# EAGLE design ADK_MEGA_2560-REV3 (EAGLE 6.5.0)
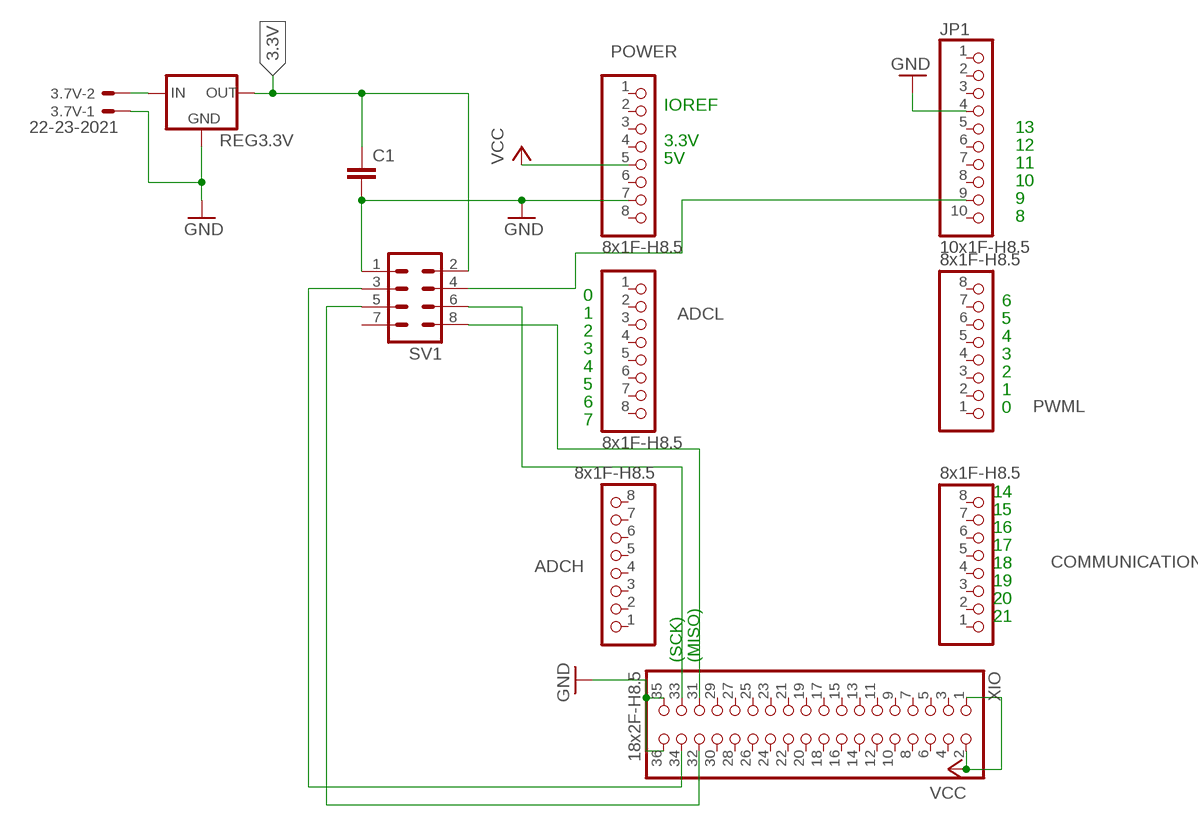
[diagram p0: schematic, sheet 1]

## Parts
3.7V  22-23-2021  [22-23-2021]
ADCH  8x1F-H8.5  PINHD-1X8  [1X08]
ADCL  8x1F-H8.5  PINHD-1X8  [1X08]
C1  C-EU025-025X050  [C025-025X050]
COMMUNICATION  8x1F-H8.5  PINHD-1X8  [1X08]
JP1  10x1F-H8.5  PINHD-1X10  [1X10]
POWER  8x1F-H8.5  PINHD-1X8  [1X08]
PWML  8x1F-H8.5  PINHD-1X8  [1X08]
REG3.3V  78XXL  [78XXL]
SV1  MA04-2  [MA04-2]
XIO  18x2F-H8.5  PINHD-2X18  [2X18]

## Nets
3.3V: C1.1 REG3.3V.OUT SV1.2
GND: 3.7V.1 C1.2 JP1.4 POWER.7 REG3.3V.GND SV1.1 XIO.35 XIO.36
N$1: SV1.3 XIO.34
N$5: SV1.5 XIO.32
N$6: JP1.9 SV1.4
N$7: SV1.6 XIO.33
N$8: SV1.8 XIO.31
N$9: 3.7V.2 REG3.3V.IN
VCC: POWER.5 XIO.1 XIO.2
Unconnected: ADCH.1 ADCH.2 ADCH.3 ADCH.4 ADCH.5 ADCH.6 ADCH.7 ADCH.8 ADCL.1 ADCL.2 ADCL.3 ADCL.4 ADCL.5 ADCL.6 ADCL.7 ADCL.8 COMMUNICATION.1 COMMUNICATION.2 COMMUNICATION.3 COMMUNICATION.4 COMMUNICATION.5 COMMUNICATION.6 COMMUNICATION.7 COMMUNICATION.8 JP1.1 JP1.2 JP1.3 JP1.5 JP1.6 JP1.7 JP1.8 JP1.10 POWER.1 POWER.2 POWER.3 POWER.4 POWER.6 POWER.8 PWML.1 PWML.2 PWML.3 PWML.4 PWML.5 PWML.6 PWML.7 PWML.8 SV1.7 XIO.3 XIO.4 XIO.5 XIO.6 XIO.7 XIO.8 XIO.9 XIO.10 XIO.11 XIO.12 XIO.13 XIO.14 XIO.15 XIO.16 XIO.17 XIO.18 XIO.19 XIO.20 XIO.21 XIO.22 XIO.23 XIO.24 XIO.25 XIO.26 XIO.27 XIO.28 XIO.29 XIO.30

## Notes on the sheet
- IOREF
- 13
- 3.3V | 12
- 5V | 11
- 10
- 9
- 8
- 0
- 1 | 6
- 2 | 5
- 3 | 4
- 4 | 3
- 5 | 2
- 6 | 1
- 7 | 0
- 14
- 15
- 16
- 17
- 18
- 19
- 20
- 21
- (SCK) | (MISO)

## Library data of the parts
3.7V = con-molex:22-23-2021: .100" (2.54mm) Center Header - 2 Pin; MF: MOLEX; MPN: 22-23-2021; OC_FARNELL: 1462926; OC_NEWARK: 25C3832
ADCH ADCL COMMUNICATION POWER PWML = SmartPrj:PINHD-1X8: PIN HEADER
C1 = rcl:C-EU: CAPACITOR, European symbol
JP1 = SmartPrj:PINHD-1X10: PIN HEADER
REG3.3V = v-reg:78XXL: VOLTAGE REGULATOR
SV1 = con-lstb:MA04-2: PIN HEADER; OC_FARNELL: unknown; OC_NEWARK: unknown
XIO = SmartPrj:PINHD-2X18: PIN HEADER

## Net classes
0 default: width 0.203 mm, drill 0.406 mm, clearance 0.178 mm
1 power: width 0.305 mm, drill 0.406 mm, clearance 0.178 mm
2 gnd: width 0.305 mm, drill 0.406 mm, clearance 0.178 mm
3 power usb: width 0.508 mm, drill 0.406 mm, clearance 0.178 mm

## Board
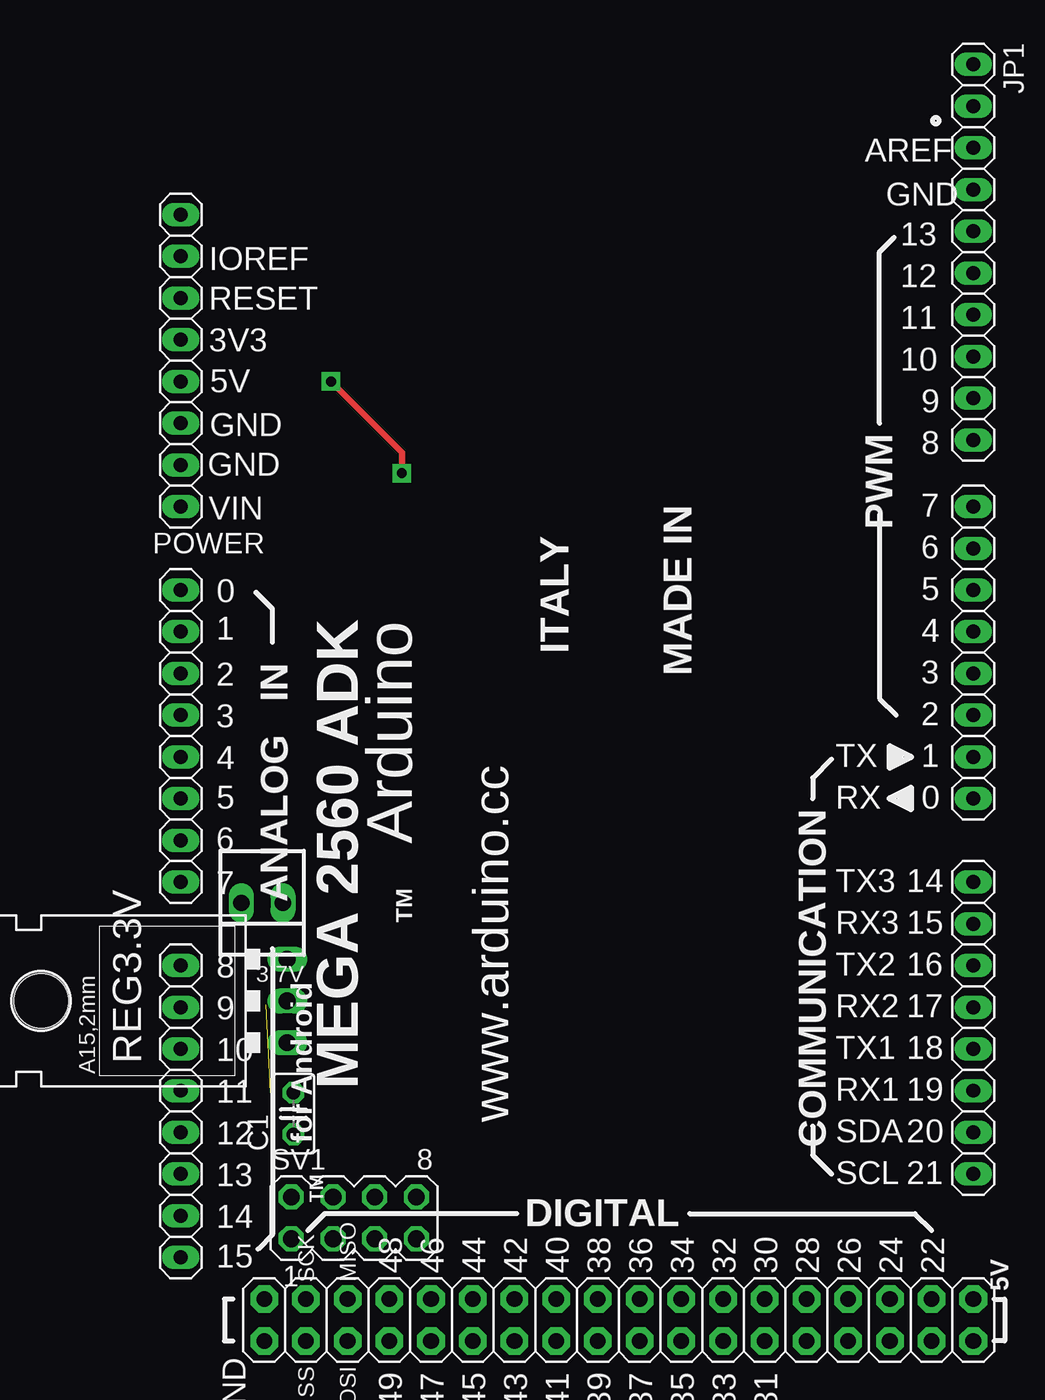
[diagram p1: board, top side]
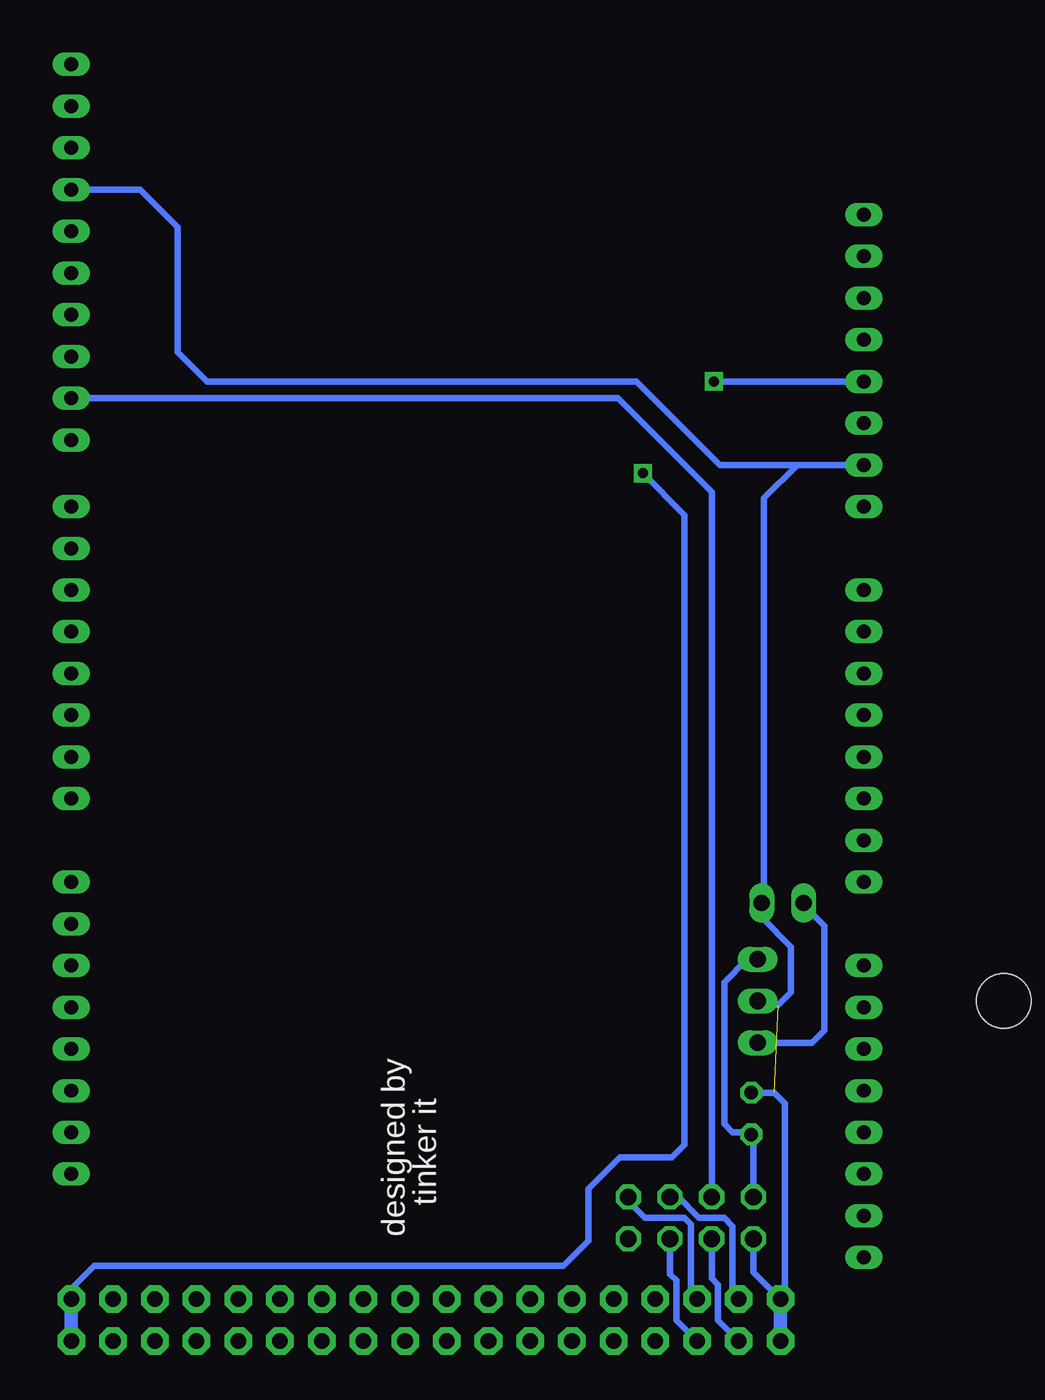
[diagram p2: board, bottom side, seen from below]

No outline drawn. Coordinates in mm, seen from the top.
Copper layers (1*16): Top 0.035mm / dielectric 1.5mm / Bottom 0.035mm
Design rules "ArduinoMegaHOST *": minimum track width 8mil, minimum drill 16mil, track to track 7mil, track to pad 7mil, pad to pad 7mil, via to via 10mil, smd to smd 7mil, copper to edge 20mil, drill to drill 12mil, minimum pad ring 10mil, minimum via ring 10mil, stop-mask expansion 2mil, vias tented up to drill 20mil, thermal gap 10mil

### Footprints (pad centres in the part's own frame; a part is rotated, then mirrored left to right if it is on the bottom)
22-23-2021 = drill 1 long: 1 -1.27,0; 2 1.27,0
1X08 = drill 0.85 pad 1.422 long: 1 -8.89,0; 2 -6.35,0; 3 -3.81,0; 4 -1.27,0; 5 1.27,0; 6 3.81,0; 7 6.35,0; 8 8.89,0
C025-025X050 = drill 0.813 octagon: 1 -1.27,0; 2 1.27,0
1X10 = drill 0.85 pad 1.422 long: 1 -11.43,0; 2 -8.89,0; 3 -6.35,0; 4 -3.81,0; 5 -1.27,0; 6 1.27,0; 7 3.81,0; 8 6.35,0; 9 8.89,0; 10 11.43,0
78XXL = drill 1.016 long: GND 0,-3.81; IN -2.54,-3.81; OUT 2.54,-3.81 | hole 3.302: 0,11.176
MA04-2 = drill 1.016 octagon: 1 -3.81,-1.27; 2 -3.81,1.27; 3 -1.27,-1.27; 4 -1.27,1.27; 5 1.27,-1.27; 6 1.27,1.27; 7 3.81,-1.27; 8 3.81,1.27
2X18 = drill 0.95 pad 1.676 octagon: 1 -21.59,-1.27; 2 -21.59,1.27; 3 -19.05,-1.27; 4 -19.05,1.27; 5 -16.51,-1.27; 6 -16.51,1.27; 7 -13.97,-1.27; 8 -13.97,1.27; 9 -11.43,-1.27; 10 -11.43,1.27; 11 -8.89,-1.27; 12 -8.89,1.27; 13 -6.35,-1.27; 14 -6.35,1.27; 15 -3.81,-1.27; 16 -3.81,1.27; 17 -1.27,-1.27; 18 -1.27,1.27; 19 1.27,-1.27; 20 1.27,1.27; 21 3.81,-1.27; 22 3.81,1.27; 23 6.35,-1.27; 24 6.35,1.27; 25 8.89,-1.27; 26 8.89,1.27; 27 11.43,-1.27; 28 11.43,1.27; 29 13.97,-1.27; 30 13.97,1.27; 31 16.51,-1.27; 32 16.51,1.27; 33 19.05,-1.27; 34 19.05,1.27; 35 21.59,-1.27; 36 21.59,1.27

### Placement (x,y rotation side)
3.7V  11.05,32.13 180 top
ADCH  6.1,19.43 270 top
ADCL  6.1,42.29 270 top
C1  12.95,19.3 90 top
COMMUNICATION  54.36,24.51 90 top
JP1  54.36,71.75 270 top
POWER  6.1,65.15 270 top
PWML  54.36,47.37 90 top
REG3.3V  8.76,26.16 90 top
SV1  16.64,12.95 0 top
XIO  32.77,6.73 180 top

### Tracks (layer width: path | path; a pad name or v marks a point on that pad's centre or on a via)
3.3V
  Bottom 0.406: SV1.2 12.83,17.91 C1.1 13.08,18.16 14.1,18.16 14.61,18.67 14.61,27.3 13.21,28.7 REG3.3V.OUT
GND  (1 unrouted)
  Bottom 0.406: SV1.1 12.83,9.65 XIO.35 10.92,8.26 10.92,19.94 11.56,20.57 C1.2 | REG3.3V.GND 12.32,25.91 11.3,25.91 10.54,26.67 10.54,29.46 12.32,31.24 3.7V.1 12.19,32.26 12.19,56.77 10.16,58.8 POWER.7 14.86,58.8 19.94,63.88 46.1,63.88 47.88,65.66 47.88,73.28 50.16,75.56 JP1.4
  Bottom 0.813: XIO.35 XIO.36 11.43,5.21
N$1
  Bottom 0.406: SV1.3 15.37,9.27 14.99,8.89 14.99,6.73 XIO.34
N$5
  Bottom 0.406: SV1.5 17.91,9.53 17.53,9.14 17.53,6.73 XIO.32
N$6
  Bottom 0.406: SV1.4 15.37,57.15 21.08,62.87 JP1.9
N$7
  Bottom 0.406: SV1.6 17.4,14.22 16.13,12.95 14.61,12.95 14.1,12.45 14.1,8.38 XIO.33
N$8
  Bottom 0.406: SV1.8 20.45,13.97 19.43,12.95 17.02,12.95 16.64,12.57 16.64,8.38 XIO.31
N$9
  Bottom 0.406: 3.7V.2 9.78,32 8.51,30.73 8.51,24.38 9.27,23.62 REG3.3V.IN
VCC  (via drill 0.6)
  Top 0.406: v19.56,58.29 19.56,59.56 v15.24,63.88
  Bottom 0.406: XIO.1 54.36,8.64 52.96,10.03 24.38,10.03 22.86,11.56 22.86,14.73 20.95,16.64 17.78,16.64 17.02,17.4 17.02,55.75 v19.56,58.29 | v15.24,63.88 POWER.5
  Bottom 0.813: XIO.2 XIO.1

### Text on the board
tNames: AREF | GND | 13 | IOREF | 12 | RESET | 11 | 3V3 | 10 | 5V | 9 | GND | PWM | 8 | GND | MADE IN | 7 | VIN | ITALY | 6 | 5 | 0 | MEGA 2560 ADK | Arduino | 1 | 4 | ANALOG IN | 2 | 3 | 3 | 2 | www.arduino.cc | 4 | TX | 1 | 5 | RX | 0 | 6 | 7 | TM | TX3 | 14 | RX3 | 15 | 8 | TX2 | 16 | for Android | 9 | RX2 | 17 | TX1 | 18 | 10 | 11 | RX1 | 19 | SDA | 20 | 12 | TM | 13 | SCL | 21 | MISO | 14 | SCK | 48 | 46 | 44 | 42 | DIGITAL | 40 | 38 | 36 | 34 | 32 | 30 | 28 | 26 | 24 | 22 | 15 | 5V | GND | SS | MOSI | 49 | 47 | 45 | 43 | 41 | 39 | 37 | 35 | 33 | 31
bNames: tinker it | designed by